# Altium project chicken.PrjPcb
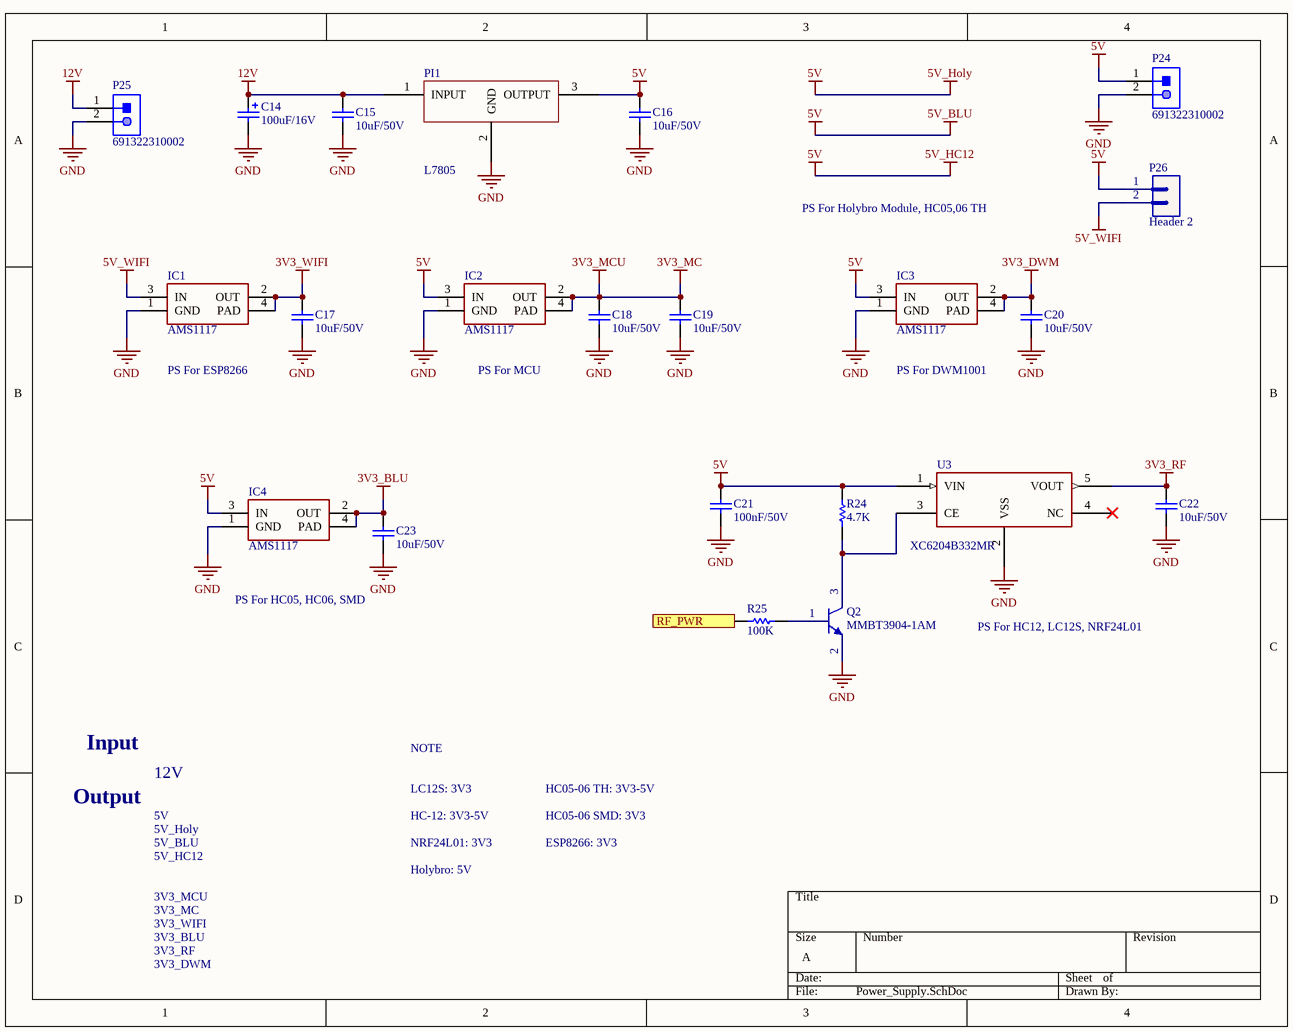
[diagram p0: Power_Supply.SchDoc]
8 sheets, 150 parts. Net scope: flat (ports and power ports of the same name join across sheets).
Board files: chicken.PcbDoc, test.PcbDoc, final.PcbDoc
Sheets:
  Power_Supply.SchDoc
  MCU.SchDoc
  Sensor.SchDoc
  Blutooth.SchDoc
  Wifi.SchDoc
  Motor Control.SchDoc
  RF.SchDoc
  Decawave.SchDoc

## Sheet Power_Supply.SchDoc
size A

### Parts
C14  value 100uF/16V  [CAP-SM-AL-SIZE-D-D6L6]  (hidden comment: Cap-Al-100uF-16V-D6L5)
C15  value 10uF/50V  [CAP-SM-0805]  (hidden comment: Cap-10uF-50V-0805)
C16  value 10uF/50V  [CAP-SM-0805]  (hidden comment: Cap-10uF-50V-0805)
C17  value 10uF/50V  [CAP-SM-0805]  (hidden comment: Cap-10uF-50V-0805)
C18  value 10uF/50V  [CAP-SM-0805]  (hidden comment: Cap-10uF-50V-0805)
C19  value 10uF/50V  [CAP-SM-0805]  (hidden comment: Cap-10uF-50V-0805)
C20  value 10uF/50V  [CAP-SM-0805]  (hidden comment: Cap-10uF-50V-0805)
C21  value 100nF/50V  [CAP-SM-0805]  (hidden comment: Cap-100nF-50V-0805)
C22  value 10uF/50V  [CAP-SM-0805]  (hidden comment: Cap-10uF-50V-0805)
C23  value 10uF/50V  [CAP-SM-0805]  (hidden comment: Cap-10uF-50V-0805)
IC1  AMS1117  [SOT223]
IC2  AMS1117  [SOT223]
IC3  AMS1117  [SOT223]
IC4  AMS1117  [SOT223]
P24  691322310002  [691322310002]
P25  691322310002  [691322310002]
P26  Header 2  [JP2]
PI1  L7805  [L7805_SMD]
Q2  MMBT3904-1AM  [SOT23_NEX]
R24  value 4.7K  [RES-SM-0805]  (hidden comment: Res-4.7K-0805)
R25  value 100K  [RES-SM-0805]  (hidden comment: Res-100K-0805)
U3  XC6204B332MR  [XC6204/05_SOT-00]

### Ports
RF_PWR (in)

### Nets
3V3_BLU: C23.2 IC4.2(OUT) IC4.4(PAD)
3V3_DWM: C20.2 IC3.2(OUT) IC3.4(PAD)
3V3_MC: C18.2 C19.2 IC2.2(OUT) IC2.4(PAD)  [also labelled 3V3_MCU]  [project net VDD]
3V3_RF: C22.2 U3.5(VOUT)
3V3_WIFI: C17.2 IC1.2(OUT) IC1.4(PAD)
5V: C16.2 C21.2 IC2.3(IN) IC3.3(IN) IC4.3(IN) P24.1 P26.1 PI1.3(OUTPUT) R24.2 U3.1(VIN)  [also labelled 5V_BLU, 5V_HC12, 5V_Holy]
5V_WIFI: IC1.3(IN) P26.2
12V: C14.1 C15.2 P25.1 PI1.1(INPUT)
GND: C14.2 C15.1 C16.1 C17.1 C18.1 C19.1 C20.1 C21.1 C22.1 C23.1 IC1.1(GND) IC2.1(GND) IC3.1(GND) IC4.1(GND) P24.2 P25.2 PI1.2(GND) Q2.2(E) U3.2(VSS)  [project net VSS]
NetCR1_15: R25.1 ; port RF_PWR
NetQ2_1: Q2.1(B) R25.2
NetQ2_3: Q2.3(C) R24.1 U3.3(CE)

Not connected (* = marked no-connect by the designer): U3 4(NC)*

### Notes on the sheet
- PS For Holybro Module, HC05,06 TH
- PS For ESP8266
- PS For MCU
- PS For DWM1001
- PS For HC05, HC06, SMD
- PS For HC12, LC12S, NRF24L01
- Input
- 12V
- NOTE
- Output
- 5V
- 5V_Holy
- 5V_BLU
- LC12S: 3V3
- HC-12: 3V3-5V
- NRF24L01: 3V3
- HC05-06 TH: 3V3-5V
- HC05-06 SMD: 3V3
- ESP8266: 3V3
- 5V_HC12
- 3V3_MCU
- 3V3_MC
- Holybro: 5V
- 3V3_WIFI
- 3V3_BLU
- 3V3_RF
- 3V3_DWM

### Library data of the parts
C14 = Cap-Al-100uF-16V-D6L5: CAP ALUM 100UF 20% 16V SMD; Manufacturer: Nichicon; Manufacturer Part Number: UWX1C101MCL1GB; Local Supplier: thegioiic; Local Supplier Link: https://thegioiic.com/products/tu-nhom-smd-100uf-16v-d6-3l5-4; Supplier 1: Digikey; Supplier 1 Part Number: 493-2105-1-ND; Supplier 1 Link: https://www.digikey.com/product-detail/en/nichicon/UWX1C101MCL1GB/493-2105-1-ND/590080
C15-C20 C22 C23 = Cap-10uF-50V-0805: CAP CER 10UF 50V X5R 0805; Manufacturer: Yageo; Manufacturer Part Number: CC0805KKX5R9BB106; Local Supplier: thegioiic; Local Supplier Link: https://thegioiic.com/products/tu-10uf-50v-0805; Supplier 1: Digikey; Supplier 1 Link: https://www.digikey.com/product-detail/en/yageo/CC0805KKX5R9BB106/311-3499-2-ND/7164383; Supplier 1 Part Number: 311-3499-2-ND
C21 = Cap-100nF-50V-0805: CAP CER 0.1UF 50V Y5V 0805; Manufacturer: Samsung Electro-Mechanics; Manufacturer Part Number: CL21F104ZBCNNNC; Local Supplier: thegioiic; Local Supplier Link: https://thegioiic.com/products/tu-100nf-0-1uf-50v-0805; Supplier 1: Digikey; Supplier 1 Part Number: 1276-1007-1-ND; Supplier 1 Link: https://www.digikey.com/product-detail/en/samsung-electro-mechanics/CL21F104ZBCNNNC/1276-1007-1-ND/3889093
IC1-IC4 = AMS1117: Available in 1.8V, 2.5V, 2.85V, 3.3V, 5V, and  Adjustable Versions; Value: LM317
P24 P25 = 691322310002: WR-TBL Serie 322 Horizontal PCB Header, Pluggable, pitch 3.81mm, 2p; Compliance: RoHS; Modularity: No; Pin Number: 2; Rated Current [UL]: 10A; Working Voltage [UL]: 300VAC; ComponentLink1Description: Manufacturer; ComponentLink1URL: http://www.we-online.de; ComponentLink2URL: https://katalog.we-online.de/em/datasheet/691322310002.pdf; ComponentLink2Description: Datasheet; Mounting Technology: THT; Part Number: 691322310002; Packaging: Box; Operating Temperature: -40 to +105degC; PCB/Cable/Panel: PCB; Pitch: 3.81mm; Published Date: October 2019; Type: Horizontal; Publisher: Wurth Elektronik; Application: Pluggable
P26 = Header 2: Header, 2-Pin; LatestRevisionDate: 17-Jul-2002; LatestRevisionNote: Re-released for DXP Platform.; Publisher: Altium Limited
R24 = Res-4.7K-0805: RES SMD 4.7K OHM 5% 1/8W 0805; Manufacturer: Yageo; Manufacturer Part Number: RC0805JR-074K7L; Local Supplier: thegioiic; Local Supplier Link: https://thegioiic.com/products/dien-tro-4-7k-ohm-0805-5; Supplier 1: Digikey; Supplier 1 Link: https://www.digikey.com/product-detail/en/yageo/RC0805JR-074K7L/311-4.7KARCT-ND/731274; Supplier 1 Part Number: 311-4.7KARCT-ND
R25 = Res-100K-0805: RES 0 OHM JUMPER 0805; Manufacturer: Vishay Dale; Manufacturer Part Number: WSL080500000ZEA9; Local Supplier: thegioiic; Local Supplier Link: https://thegioiic.com/products/dien-tro-0-ohm-0805-5; Supplier 1: Digikey; Supplier 1 Link: https://www.digikey.com/product-detail/en/vishay-dale/WSL080500000ZEA9/541-3928-1-ND/7423223; Supplier 1 Part Number: 541-3928-1-ND
U3 = XC6204B332MR: Vendor: Torex Semiconductor; Built_By: EMA_UL_Team; SourceLibrary: Torex_2016-07-05_1; Manufacturer_Part_Number: XC6204B332MR; Copyright: Copyright (C) 2018 Accelerated Designs. All rights reserved; RefDes: RefDes; Type: DEV

## Sheet MCU.SchDoc
size A
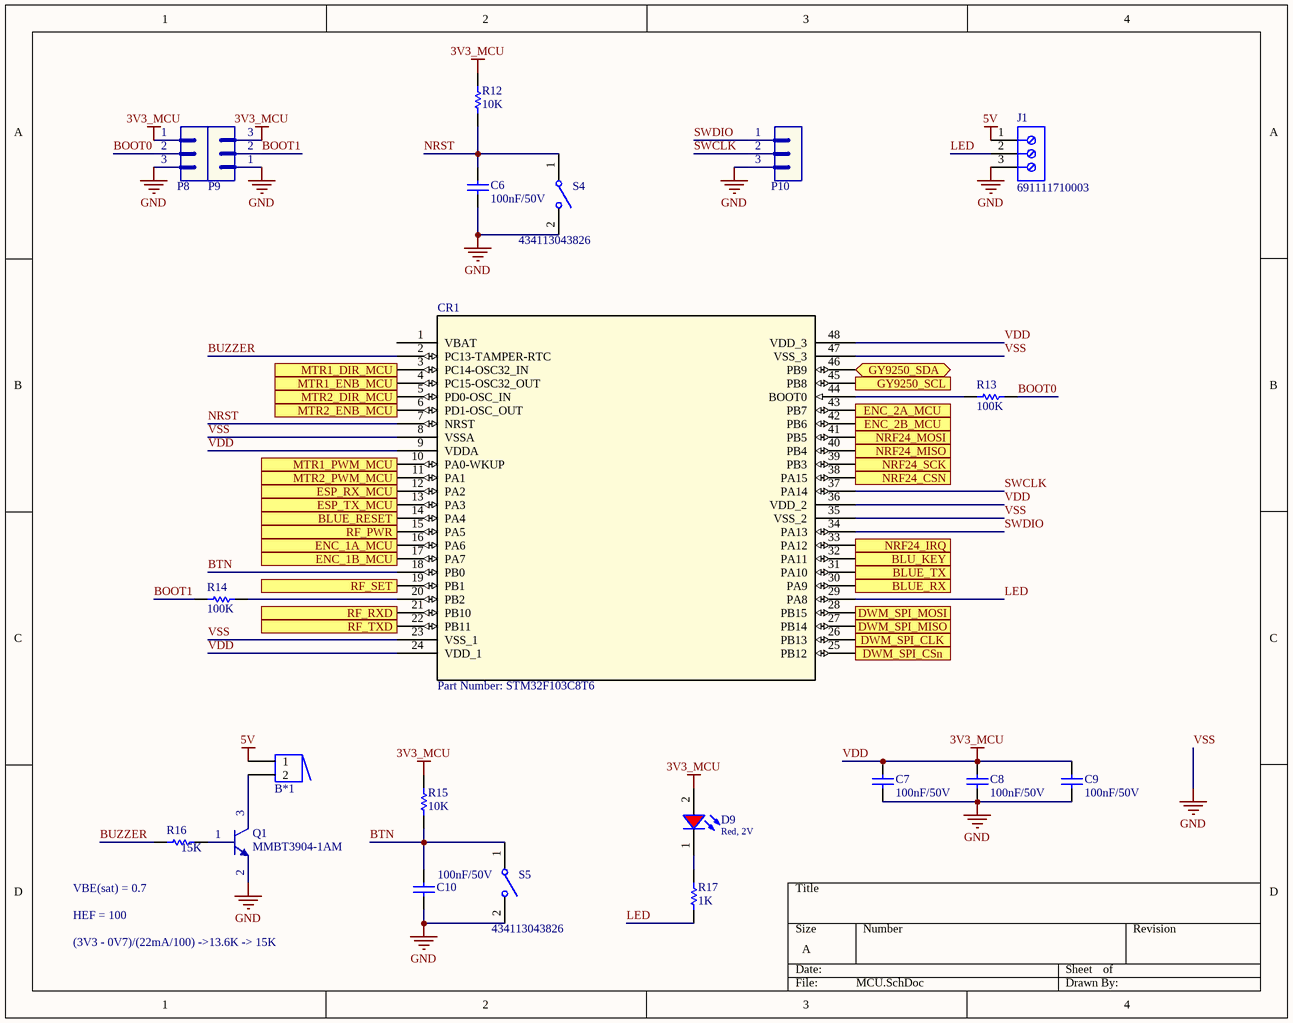
[diagram p1: MCU.SchDoc]

### Parts
B*1  Buzzer  [BUZZER]  (value not drawn)
C6  value 100nF/50V  [CAP-SM-0805]  (hidden comment: Cap-100nF-50V-0805)
C7  value 100nF/50V  [CAP-SM-0805]  (hidden comment: Cap-100nF-50V-0805)
C8  value 100nF/50V  [CAP-SM-0805]  (hidden comment: Cap-100nF-50V-0805)
C9  value 100nF/50V  [CAP-SM-0805]  (hidden comment: Cap-100nF-50V-0805)
C10  value 100nF/50V  [CAP-SM-0805]  (hidden comment: Cap-100nF-50V-0805)
CR1  Part Number: STM32F103C8T6  [LQFP-48]
D9  Red, 2V  [WL-SMCW_0805]
J1  691111710003  [691111710003]
P8  Header 3  [JP3]  (value not drawn)
P9  Header 3  [JP3]  (value not drawn)
P10  Header 3  [JP3]  (value not drawn)
Q1  MMBT3904-1AM  [SOT23_NEX]
R12  value 10K  [RES-SM-0805]  (hidden comment: Res-10k-0805)
R13  value 100K  [RES-SM-0805]  (hidden comment: Res-100K-0805)
R14  value 100K  [RES-SM-0805]  (hidden comment: Res-100K-0805)
R15  value 10K  [RES-SM-0805]  (hidden comment: Res-10k-0805)
R16  value 15K  [RES-SM-0805]  (hidden comment: Res-15K-0805)
R17  value 1K  [RES-SM-0805]  (hidden comment: Res-1K-0805)
S4  434113043826  [434113043826]
S5  434113043826  [434113043826]

### Ports
BLU_KEY (out), BLUE_RESET (out), BLUE_RX (out), BLUE_TX (in), DWM_SPI_CLK (out), DWM_SPI_CSn (out), DWM_SPI_MISO (in), DWM_SPI_MOSI (out), ENC_1A_MCU, ENC_1B_MCU, ENC_2A_MCU (in), ENC_2B_MCU (in), ESP_RX_MCU (out), ESP_TX_MCU (out), GY9250_SCL (out), GY9250_SDA (bidir), MTR1_DIR_MCU (out), MTR1_ENB_MCU (out), MTR1_PWM_MCU (out), MTR2_DIR_MCU (out), MTR2_ENB_MCU (out), MTR2_PWM_MCU, NRF24_CSN (out), NRF24_IRQ (in), NRF24_MISO (in), NRF24_MOSI (out), NRF24_SCK (out), RF_PWR, RF_RXD (out), RF_SET (out), RF_TXD (in)

### Nets
5V: B*1.1 J1.1
VDD: C7.2 C8.1 C9.1 CR1.9(VDDA) CR1.24(VDD_1) CR1.36(VDD_2) CR1.48(VDD_3) D9.2(A) P8.1 P9.3 R12.2 R15.2  [also labelled 3V3_MCU]
VSS: C6.1 C7.1 C8.2 C9.2 C10.1 CR1.8(VSSA) CR1.23(VSS_1) CR1.35(VSS_2) CR1.47(VSS_3) J1.3 P8.3 P9.1 P10.3 Q1.2(E) S4.2 S5.2  [also labelled GND]
BLU_KEY: CR1.32(PA11) ; port BLU_KEY
BLUE_RX: CR1.30(PA9) ; port BLUE_RX
BLUE_TX: CR1.31(PA10) ; port BLUE_TX
BOOT0: P8.2 R13.2
BOOT1: P9.2 R14.1
BTN: C10.2 CR1.18(PB0) R15.1 S5.1
BUZZER: CR1.2(PC13-TAMPER-RTC) R16.1
DWM_SPI_CLK: CR1.26(PB13) ; port DWM_SPI_CLK
DWM_SPI_CSn: CR1.25(PB12) ; port DWM_SPI_CSn
DWM_SPI_MISO: CR1.27(PB14) ; port DWM_SPI_MISO
DWM_SPI_MOSI: CR1.28(PB15) ; port DWM_SPI_MOSI
ESP_TX: CR1.13(PA3) ; port ESP_TX_MCU
LED: CR1.29(PA8) J1.2 R17.1
NRST: C6.2 CR1.7(NRST) R12.1 S4.1
RF_RXD: CR1.21(PB10) ; port RF_RXD
RF_SET: CR1.19(PB1) ; port RF_SET
RF_TXD: CR1.22(PB11) ; port RF_TXD
SWCLK: CR1.37(PA14) P10.2
SWDIO: CR1.34(PA13) P10.1
Net*1_11: CR1.14(PA4) ; port BLUE_RESET
NetB*1_2: B*1.2 Q1.3(C)
NetCR1_3: CR1.3(PC14-OSC32_IN) ; port MTR1_DIR_MCU
NetCR1_4: CR1.4(PC15-OSC32_OUT) ; port MTR1_ENB_MCU
NetCR1_5: CR1.5(PD0-OSC_IN) ; port MTR2_DIR_MCU
NetCR1_6: CR1.6(PD1-OSC_OUT) ; port MTR2_ENB_MCU
NetCR1_10: CR1.10(PA0-WKUP) ; port MTR1_PWM_MCU
NetCR1_11: CR1.11(PA1) ; port MTR2_PWM_MCU
NetCR1_12: CR1.12(PA2) ; port ESP_RX_MCU
NetCR1_15: CR1.15(PA5) ; port RF_PWR
NetCR1_16: CR1.16(PA6) ; port ENC_1A_MCU
NetCR1_17: CR1.17(PA7) ; port ENC_1B_MCU
NetCR1_20: CR1.20(PB2) R14.2
NetCR1_33: CR1.33(PA12) ; port NRF24_IRQ
NetCR1_38: CR1.38(PA15) ; port NRF24_CSN
NetCR1_39: CR1.39(PB3) ; port NRF24_SCK
NetCR1_40: CR1.40(PB4) ; port NRF24_MISO
NetCR1_41: CR1.41(PB5) ; port NRF24_MOSI
NetCR1_42: CR1.42(PB6) ; port ENC_2B_MCU
NetCR1_43: CR1.43(PB7) ; port ENC_2A_MCU
NetCR1_44: CR1.44(BOOT0) R13.1
NetCR1_45: CR1.45(PB8) ; port GY9250_SCL
NetCR1_46: CR1.46(PB9) ; port GY9250_SDA
NetD9_1: D9.1(K) R17.2
NetQ1_1: Q1.1(B) R16.2

Not connected (* = marked no-connect by the designer): CR1 1(VBAT)

### Notes on the sheet
- (near R16) VBE(sat) = 0.7
- HEF = 100
- (3V3 - 0V7)/(22mA/100) ->13.6K -> 15K

### Library data of the parts
C6-C10 = Cap-100nF-50V-0805: as C21 on sheet Power_Supply; Local Supplier: thegioiic; Local Supplier Link: https://thegioiic.com/products/tu-100nf-0-1uf-50v-0805; Supplier 1: Digikey; Supplier 1 Part Number: 1276-1007-1-ND; Supplier 1 Link: https://www.digikey.com/product-detail/en/samsung-electro-mechanics/CL21F104ZBCNNNC/1276-1007-1-ND/3889093
CR1 = STM32F103C8T6: No Description Available; Vendor: STMicroelectronics; Built_By: EMA_UL_Team; Type: DEV; Manufacturer_Part_Number: STM32F103C8T6; Copyright: Copyright (C) 2018 Accelerated Designs. All rights reserved; RefDes: RefDes; Value: Value
D9 = 150080RS75000: WL-SMCW SMT Mono-color Chip LED Waterclear, size 0805, Red, 2V, 140deg; Chip Technology: AlInGaP; Dominant Wavelength typ.: 625nm; Luminous Intensity typ.: 150mcd; Peak Wavelength typ.: 630nm; Viewing Angle: 140deg; ComponentLink1Description: Manufacturer; ComponentLink1URL: http://www.we-online.de; ComponentLink2URL: https://www.we-online.com/catalog/datasheet/150080RS75000.pdf; ComponentLink2Description: Datasheet; Forward Voltage typ.: 2V; Emitting Color: Red; Mounting Technology: SMT; Operating Temperature: -40 to +85degC; Published Date: December 2019; Part Number: 150080RS75000; Packaging: Tape and Reel; Size: 0805; Publisher: Wurth Elektronik
J1 = 691111710003: WR-TBL Serie 111 Horizontal Entry Modular, Pressure Clamp, pitch 5mm, 3p; Compliance: Lead free / RoHS; Modularity: Yes; PCB/Cable/Panel: PCB; Pin Number: 3; Rated Current [UL]: 15A; Working Voltage [UL]: 250VAC; ComponentLink1Description: Manufacturer; ComponentLink1URL: http://www.we-online.de; ComponentLink2URL: https://katalog.we-online.de/em/datasheet/691111710003.pdf; ComponentLink2Description: Datasheet; Mounting Technology: THT; Part Number: 691111710003; Packaging: Box; Operating Temperature: -40 to +105degC; Pitch: 5mm; Published Date: October 2019; Type: Horizontal; Publisher: Wurth Elektronik; Application: Pressure Clamp
P8-P10 = Header 3: Header, 3-Pin; LatestRevisionDate: 17-Jul-2002; LatestRevisionNote: Re-released for DXP Platform.; Publisher: Altium Limited
R12 R15 = Res-10k-0805: RES 10K OHM 1% 1/4W 0805; Manufacturer: Stackpole Electronics Inc; Manufacturer Part Number: RNCP0805FTD10K0; Local Supplier: thegioiic; Local Supplier Link: https://thegioiic.com/products/dien-tro-10k-ohm-0805-5; Supplier 1: Digikey; Supplier 1 Link: https://www.digikey.com/product-detail/en/stackpole-electronics-inc/RNCP0805FTD10K0/RNCP0805FTD10K0CT-ND/2240601; Supplier 1 Part Number: RNCP0805FTD10K0CT-ND
R13 R14 = Res-100K-0805: as R25 on sheet Power_Supply; Local Supplier: thegioiic; Local Supplier Link: https://thegioiic.com/products/dien-tro-0-ohm-0805-5; Supplier 1: Digikey; Supplier 1 Link: https://www.digikey.com/product-detail/en/vishay-dale/WSL080500000ZEA9/541-3928-1-ND/7423223; Supplier 1 Part Number: 541-3928-1-ND
R16 = Res-15K-0805: RES 15K OHM 1% 1/4W 0805; Manufacturer: TE Connectivity Passive Product; Manufacturer Part Number: CRGCQ0805F15K; Local Supplier: thegioiic; Local Supplier Link: https://thegioiic.com/products/dien-tro-15k-ohm-0805-1; Supplier 1: Digikey; Supplier 1 Part Number: A129763CT-ND; Supplier 1 Link: https://www.digikey.com/product-detail/en/te-connectivity-passive-product/CRGCQ0805F15K/A129763CT-ND/8577595
R17 = Res-1K-0805: RES 1K OHM 1% 1/4W 0805; Manufacturer: Stackpole Electronics Inc; Manufacturer Part Number: RNCP0805FTD1K00; Local Supplier: thegioiic; Local Supplier Link: https://thegioiic.com/products/dien-tro-1k-ohm-0805-5; Supplier 1: Digikey; Supplier 1 Link: https://www.digikey.com/product-detail/en/stackpole-electronics-inc/RNCP0805FTD1K00/RNCP0805FTD1K00CT-ND/2240568; Supplier 1 Part Number: RNCP0805FTD1K00CT-ND
S4 S5 = 434113043826: WS-TASV J-Bend SMT Tact Switch 6x3.5mm, height 4.3mm, 260gf; Rated Voltage: 12VDC; Rated Current: 50mA; Washable: No; ComponentLink1Description: Manufacturer; ComponentLink1URL: http://www.we-online.de; ComponentLink2Description: Datasheet; ComponentLink2URL: https://katalog.we-online.com/em/datasheet/434113043826.pdf; Operating Temperature: -40 to +85degC; Part Number: 434113043826; Published Date: September 2019; Contact Material: Stainless Steel; Height: 4.3mm; Mounting Technology: SMT; Contact Plating: Silver; Operation Force: 260gf; Packaging: Tape and Reel; Terminal Material: Copper Alloy; Publisher: Wurth Elektronik; Terminal Plating: Silver

## Sheet Sensor.SchDoc
size A
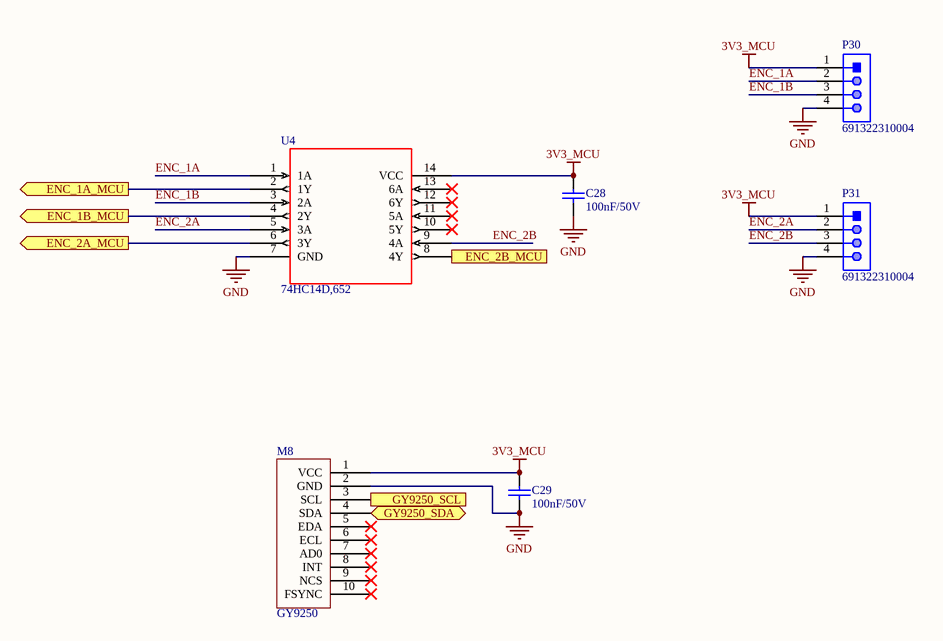
[diagram p2: Sensor.SchDoc]

### Parts
C28  value 100nF/50V  [CAP-SM-0805]  (hidden comment: Cap-100nF-50V-0805)
C29  value 100nF/50V  [CAP-SM-0805]  (hidden comment: Cap-100nF-50V-0805)
M8  GY9250  [GY9250]
P30  691322310004  [691322310004]
P31  691322310004  [691322310004]
U4  74HC14D,652  [74HC14D,652]

### Ports
ENC_1A_MCU (out), ENC_1B_MCU (out), ENC_2A_MCU (out), ENC_2B_MCU (out), GY9250_SCL (in), GY9250_SDA (bidir)

### Nets
3V3_MCU: C28.2 C29.2 M8.1(VCC) P30.1 P31.1 U4.14(VCC)  [project net VDD]
GND: C28.1 C29.1 M8.2(GND) P30.4 P31.4 U4.7(GND)  [project net VSS]
ENC_1A: P30.2 U4.1(1A)
ENC_1B: P30.3 U4.3(2A)
ENC_2A: P31.2 U4.5(3A)
ENC_2B: P31.3 U4.9(4A)
NetCR1_16: U4.2(1Y) ; port ENC_1A_MCU
NetCR1_17: U4.4(2Y) ; port ENC_1B_MCU
NetCR1_42: U4.8(4Y) ; port ENC_2B_MCU
NetCR1_43: U4.6(3Y) ; port ENC_2A_MCU
NetCR1_45: M8.3(SCL) ; port GY9250_SCL
NetCR1_46: M8.4(SDA) ; port GY9250_SDA

Not connected (* = marked no-connect by the designer): M8 5(EDA)* 6(ECL)* 7(AD0)* 8(INT)* 9(NCS)* 10(FSYNC)*; U4 10(5Y)* 11(5A)* 12(6Y)* 13(6A)*

### Library data of the parts
C28 C29 = Cap-100nF-50V-0805: as C21 on sheet Power_Supply; Local Supplier: thegioiic; Local Supplier Link: https://thegioiic.com/products/tu-100nf-0-1uf-50v-0805; Supplier 1: Digikey; Supplier 1 Part Number: 1276-1007-1-ND; Supplier 1 Link: https://www.digikey.com/product-detail/en/samsung-electro-mechanics/CL21F104ZBCNNNC/1276-1007-1-ND/3889093
P30 P31 = 691322310004: WR-TBL Serie 322 Horizontal PCB Header, Pluggable, pitch 3.81mm, 4p; Compliance: RoHS; Modularity: No; Pin Number: 4; Rated Current [UL]: 10A; Working Voltage [UL]: 300VAC; ComponentLink1Description: Manufacturer; ComponentLink1URL: http://www.we-online.de; ComponentLink2URL: https://katalog.we-online.de/em/datasheet/691322310004.pdf; ComponentLink2Description: Datasheet; Mounting Technology: THT; Part Number: 691322310004; Packaging: Box; Operating Temperature: -40 to +105degC; PCB/Cable/Panel: PCB; Pitch: 3.81mm; Published Date: October 2019; Type: Horizontal; Publisher: Wurth Elektronik; Application: Pluggable
U4 = 74HC14D,652: No Description Available; Vendor: Nexperia; SourceLibrary: Nexperia_2018-05-2018; Manufacturer_Part_Number: 74HC14D,652; Copyright: Copyright (C) 2016 Accelerated Designs. All rights reserved; RefDes: RefDes; Type: DEV
M8 = GY9250: Local Supplier: HShop; Local Supplier Link: https://hshop.vn/products/cam-bien-gy-9250-9dof-imu-mpu9250; Local Supplier Part Number: *; Manufacturer: *; Manufacturer Part Number: *

## Sheet Blutooth.SchDoc
size A
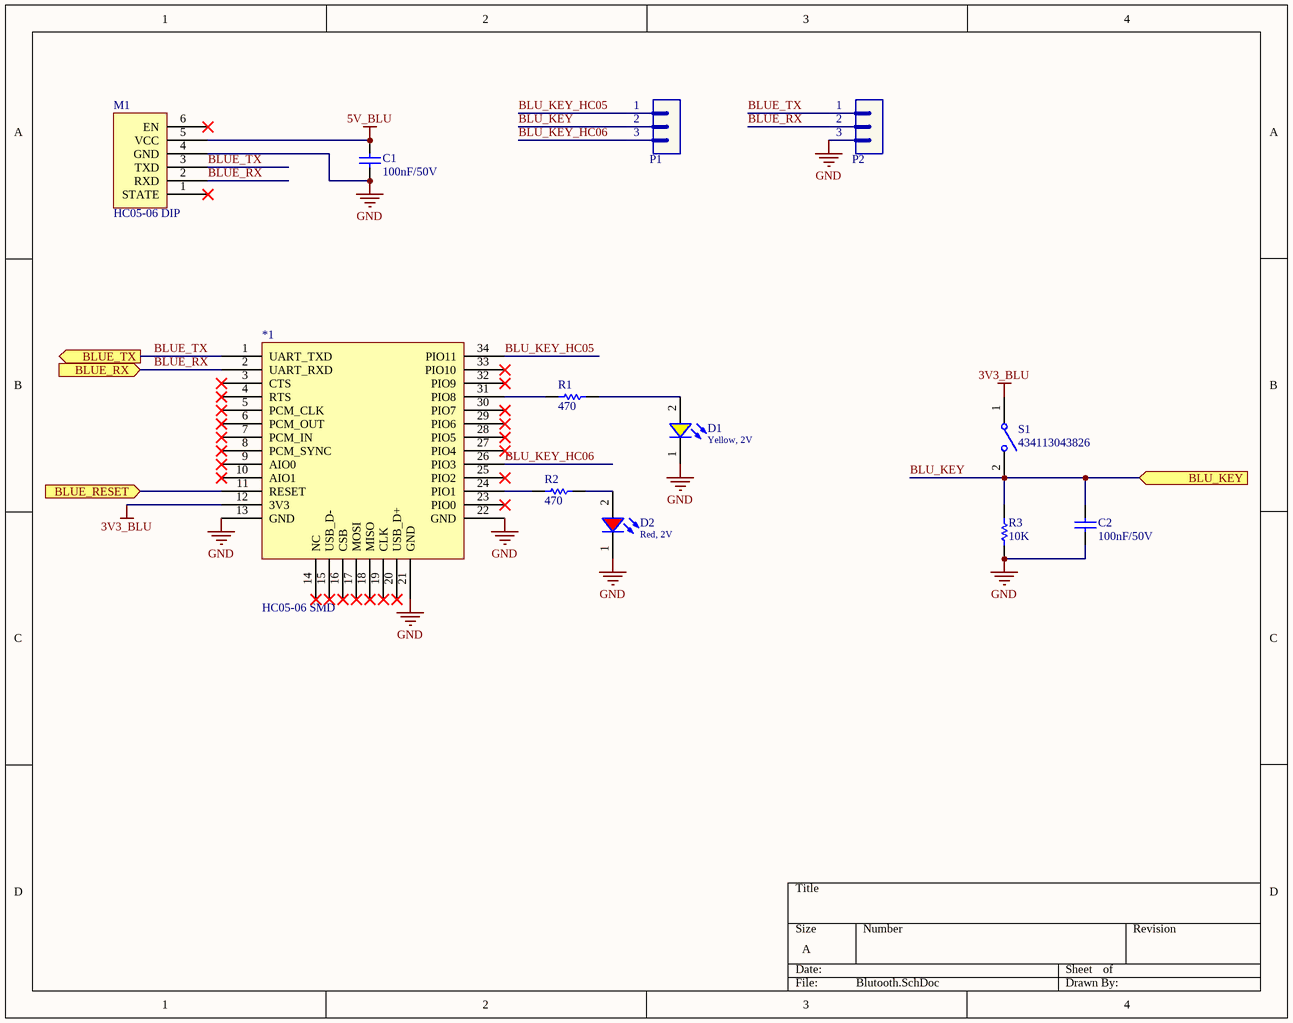
[diagram p3: Blutooth.SchDoc]

### Parts
*1  HC05-06 SMD  [HC05-06 SMD]
C1  value 100nF/50V  [CAP-SM-0805]  (hidden comment: Cap-100nF-50V-0805)
C2  value 100nF/50V  [CAP-SM-0805]  (hidden comment: Cap-100nF-50V-0805)
D1  Yellow, 2V  [WL-SMCW_0805]
D2  Red, 2V  [WL-SMCW_0805]
M1  HC05-06 DIP  [HC05-06 DIP]
P1  Header 3  [JP3]  (value not drawn)
P2  Header 3  [JP3]  (value not drawn)
R1  value 470  [RES-SM-0805]  (hidden comment: Res-470-0805)
R2  value 470  [RES-SM-0805]  (hidden comment: Res-470-0805)
R3  value 10K  [RES-SM-0805]  (hidden comment: Res-10k-0805)
S1  434113043826  [434113043826]

### Ports
BLU_KEY (in), BLUE_RESET (in), BLUE_RX (in), BLUE_TX (out)

### Nets
3V3_BLU: *1.12(3V3) S1.1
5V_BLU: C1.2 M1.5(VCC)  [project net 5V]
GND: *1.13(GND) *1.21(GND) *1.22(GND) C1.1 C2.1 D1.1(K) D2.1(K) M1.4(GND) P2.3 R3.2  [project net VSS]
BLU_KEY: C2.2 P1.2 R3.1 S1.2 ; port BLU_KEY
BLU_KEY_HC05: *1.34(PIO11) P1.1
BLU_KEY_HC06: *1.26(PIO3) P1.3
BLUE_RX: *1.2(UART_RXD) M1.2(RXD) P2.2 ; port BLUE_RX
BLUE_TX: *1.1(UART_TXD) M1.3(TXD) P2.1 ; port BLUE_TX
Net*1_11: *1.11(RESET) ; port BLUE_RESET
Net*1_24: *1.24(PIO1) R2.1
Net*1_31: *1.31(PIO8) R1.1
NetD1_2: D1.2(A) R1.2
NetD2_2: D2.2(A) R2.2

Not connected (* = marked no-connect by the designer): *1 3(CTS)* 4(RTS)* 5(PCM_CLK)* 6(PCM_OUT)* 7(PCM_IN)* 8(PCM_SYNC)* 9(AIO0)* 10(AIO1)* 14(NC)* 15(USB_D-)* 16(CSB)* 17(MOSI)* 18(MISO)* 19(CLK)* 20(USB_D+)* 23(PIO0)* 25(PIO2)* 27(PIO4)* 28(PIO5)* 29(PIO6)* 30(PIO7)* 32(PIO9)* 33(PIO10)*; M1 1(STATE)* 6(EN)*

### Library data of the parts
C1 C2 = Cap-100nF-50V-0805: as C21 on sheet Power_Supply; Local Supplier: thegioiic; Local Supplier Link: https://thegioiic.com/products/tu-100nf-0-1uf-50v-0805; Supplier 1: Digikey; Supplier 1 Part Number: 1276-1007-1-ND; Supplier 1 Link: https://www.digikey.com/product-detail/en/samsung-electro-mechanics/CL21F104ZBCNNNC/1276-1007-1-ND/3889093
D1 = 150080YS75000: WL-SMCW SMT Mono-color Chip LED Waterclear, size 0805, Yellow, 2V, 140deg; Chip Technology: AlInGaP; Dominant Wavelength typ.: 590nm; Luminous Intensity typ.: 120mcd; Peak Wavelength typ.: 595nm; Viewing Angle: 140deg; ComponentLink1Description: Manufacturer; ComponentLink1URL: http://www.we-online.de; ComponentLink2URL: https://www.we-online.com/catalog/datasheet/150080YS75000.pdf; ComponentLink2Description: Datasheet; Forward Voltage typ.: 2V; Emitting Color: Yellow; Mounting Technology: SMT; Operating Temperature: -40 to +85degC; Published Date: December 2019; Part Number: 150080YS75000; Packaging: Tape and Reel; Size: 0805; Publisher: Wurth Elektronik
D2 = 150080RS75000: as D9 on sheet MCU; Viewing Angle: 140deg; ComponentLink1Description: Manufacturer; ComponentLink1URL: http://www.we-online.de; ComponentLink2URL: https://www.we-online.com/catalog/datasheet/150080RS75000.pdf; ComponentLink2Description: Datasheet; Forward Voltage typ.: 2V; Emitting Color: Red; Mounting Technology: SMT; Operating Temperature: -40 to +85degC; Published Date: December 2019; Part Number: 150080RS75000; Packaging: Tape and Reel; Size: 0805; Publisher: Wurth Elektronik
P1 P2 = Header 3: Header, 3-Pin; LatestRevisionDate: 17-Jul-2002; LatestRevisionNote: Re-released for DXP Platform.; Publisher: Altium Limited
R1 R2 = Res-470-0805: RES 470 OHM JUMPER 0805; Manufacturer: YAG6006CT-ND; Manufacturer Part Number: PE0805FRF7W0R047L; Local Supplier: thegioiic; Local Supplier Link: https://www.thegioiic.com/products/dien-tro-470-kohm-0805-5; Supplier 1: Digikey; Supplier 1 Link: https://www.digikey.com/product-detail/en/yageo/PE0805FRF7W0R047L/YAG6006CT-ND/9696460; Supplier 1 Part Number: YAG6006CT-ND
R3 = Res-10k-0805: as R12 on sheet MCU; Local Supplier: thegioiic; Local Supplier Link: https://thegioiic.com/products/dien-tro-10k-ohm-0805-5; Supplier 1: Digikey; Supplier 1 Link: https://www.digikey.com/product-detail/en/stackpole-electronics-inc/RNCP0805FTD10K0/RNCP0805FTD10K0CT-ND/2240601; Supplier 1 Part Number: RNCP0805FTD10K0CT-ND
S1 = 434113043826: as S4 on sheet MCU; ComponentLink1Description: Manufacturer; ComponentLink1URL: http://www.we-online.de; ComponentLink2Description: Datasheet; ComponentLink2URL: https://katalog.we-online.com/em/datasheet/434113043826.pdf; Operating Temperature: -40 to +85degC; Part Number: 434113043826; Published Date: September 2019; Contact Material: Stainless Steel; Height: 4.3mm; Mounting Technology: SMT; Contact Plating: Silver; Operation Force: 260gf; Packaging: Tape and Reel; Terminal Material: Copper Alloy; Publisher: Wurth Elektronik; Terminal Plating: Silver

## Sheet Wifi.SchDoc
size A
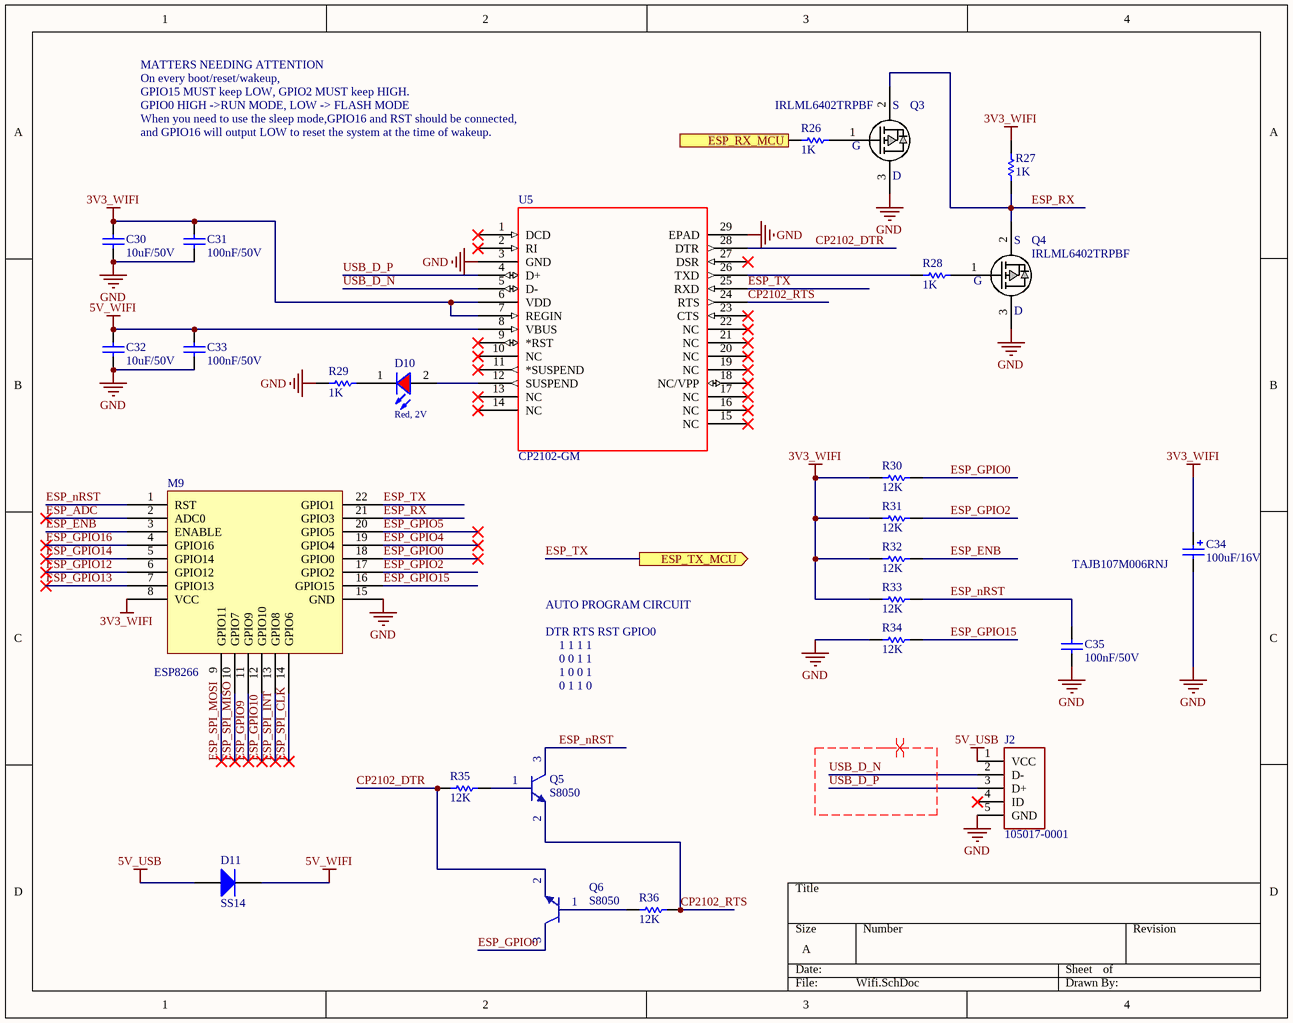
[diagram p4: Wifi.SchDoc]

### Parts
C30  value 10uF/50V  [CAP-SM-0805]  (hidden comment: Cap-10uF-50V-0805)
C31  value 100nF/50V  [CAP-SM-0805]  (hidden comment: Cap-100nF-50V-0805)
C32  value 10uF/50V  [CAP-SM-0805]  (hidden comment: Cap-10uF-50V-0805)
C33  value 100nF/50V  [CAP-SM-0805]  (hidden comment: Cap-100nF-50V-0805)
C34  value 100uF/16V  [CAP_SM_TAN]  (hidden comment: TAJB107M006RNJ)
C35  value 100nF/50V  [CAP-SM-0805]  (hidden comment: Cap-100nF-50V-0805)
D10  Red, 2V  [WL-SMCW_0805]
D11  SS14  [SS14]
J2  105017-0001  [CONN_105017-0001]
M9  ESP8266  [ESP8266]
Q3  IRLML6402TRPBF  [SOT23_NEX]
Q4  IRLML6402TRPBF  [SOT23_NEX]
Q5  S8050  [SOT23_NEX]
Q6  S8050  [SOT23_NEX]
R26  value 1K  [RES-SM-0805]  (hidden comment: Res-1K-0805)
R27  value 1K  [RES-SM-0805]  (hidden comment: Res-1K-0805)
R28  value 1K  [RES-SM-0805]  (hidden comment: Res-1K-0805)
R29  value 1K  [RES-SM-0805]  (hidden comment: Res-1K-0805)
R30  value 12K  [RES-SM-0805]  (hidden comment: Res-12K-0805)
R31  value 12K  [RES-SM-0805]  (hidden comment: Res-12K-0805)
R32  value 12K  [RES-SM-0805]  (hidden comment: Res-12K-0805)
R33  value 12K  [RES-SM-0805]  (hidden comment: Res-12K-0805)
R34  value 12K  [RES-SM-0805]  (hidden comment: Res-12K-0805)
R35  value 12K  [RES-SM-0805]  (hidden comment: Res-12K-0805)
R36  value 12K  [RES-SM-0805]  (hidden comment: Res-12K-0805)
U5  CP2102-GM  [CP2102-GM]

### Ports
ESP_RX_MCU (in), ESP_TX_MCU (out)

### Nets
3V3_WIFI: C30.2 C31.2 C34.1 M9.8(VCC) R27.2 R30.1 R31.1 R32.1 R33.1 U5.6(VDD) U5.7(REGIN)
5V_USB: D11.2(A) J2.1(VCC)
5V_WIFI: C32.2 C33.2 D11.1(K) U5.8(VBUS)
GND: C30.1 C31.1 C32.1 C33.1 C34.2 C35.1 J2.5(GND) M9.15(GND) Q3.3(D) Q4.3(D) R29.1 R34.1 U5.3(GND) U5.29(EPAD)  [project net VSS]
CP2102_DTR: Q6.2(E) R35.1 U5.28(DTR)
CP2102_RTS: Q5.2(E) R36.2 U5.24(RTS)
ESP_ADC: M9.2(ADC0)
ESP_ENB: M9.3(ENABLE) R32.2
ESP_GPIO0: M9.18(GPIO0) Q6.3(C) R30.2
ESP_GPIO2: M9.17(GPIO2) R31.2
ESP_GPIO4: M9.19(GPIO4)
ESP_GPIO5: M9.20(GPIO5)
ESP_GPIO9: M9.11(GPIO9)
ESP_GPIO10: M9.12(GPIO10)
ESP_GPIO12: M9.6(GPIO12)
ESP_GPIO13: M9.7(GPIO13)
ESP_GPIO14: M9.5(GPIO14)
ESP_GPIO15: M9.16(GPIO15) R34.2
ESP_GPIO16: M9.4(GPIO16)
ESP_nRST: C35.2 M9.1(RST) Q5.3(C) R33.2
ESP_RX: M9.21(GPIO3) Q3.2(S) Q4.2(S) R27.1
ESP_SPI_CLK: M9.14(GPIO6)
ESP_SPI_INT: M9.13(GPIO8)
ESP_SPI_MISO: M9.10(GPIO7)
ESP_SPI_MOSI: M9.9(GPIO11)
ESP_TX: M9.22(GPIO1) U5.25(RXD) ; port ESP_TX_MCU
USB_D_N: J2.2(D-) U5.5(D-)
USB_D_P: J2.3(D+) U5.4(D+)
NetCR1_12: R26.2 ; port ESP_RX_MCU
NetD10_1: D10.1(K) R29.2
NetD10_2: D10.2(A) U5.12(SUSPEND)
NetQ3_1: Q3.1(G) R26.1
NetQ4_1: Q4.1(G) R28.2
NetQ5_1: Q5.1(B) R35.2
NetQ6_1: Q6.1(B) R36.1
NetR28_1: R28.1 U5.26(TXD)

Not connected (* = marked no-connect by the designer): J2 4(ID)*; U5 1(DCD)* 2(RI)* 9(*RST)* 10(NC)* 11(*SUSPEND)* 13(NC)* 14(NC)* 15(NC)* 16(NC)* 17(NC)* 18(NC/VPP)* 19(NC)* 20(NC)* 21(NC)* 22(NC)* 23(CTS)* 27(DSR)*

### Layout directives
differential pair: USB_D_N, USB_D_P

### Notes on the sheet
- MATTERS NEEDING ATTENTION
- On every boot/reset/wakeup,
- GPIO15 MUST keep LOW, GPIO2 MUST keep HIGH.
- GPIO0 HIGH ->RUN MODE, LOW -> FLASH MODE
- When you need to use the sleep mode,GPIO16 and RST should be connected,
- and GPIO16 will output LOW to reset the system at the time of wakeup.
- (near C34) TAJB107M006RNJ
- AUTO PROGRAM CIRCUIT
- DTR RTS RST GPIO0
- 1 1 1 1
- 0 0 1 1
- 1 0 0 1
- 0 1 1 0

### Library data of the parts
C30 C32 = Cap-10uF-50V-0805: as C15 on sheet Power_Supply; Local Supplier: thegioiic; Local Supplier Link: https://thegioiic.com/products/tu-10uf-50v-0805; Supplier 1: Digikey; Supplier 1 Link: https://www.digikey.com/product-detail/en/yageo/CC0805KKX5R9BB106/311-3499-2-ND/7164383; Supplier 1 Part Number: 311-3499-2-ND
C31 C33 C35 = Cap-100nF-50V-0805: as C21 on sheet Power_Supply; Local Supplier: thegioiic; Local Supplier Link: https://thegioiic.com/products/tu-100nf-0-1uf-50v-0805; Supplier 1: Digikey; Supplier 1 Part Number: 1276-1007-1-ND; Supplier 1 Link: https://www.digikey.com/product-detail/en/samsung-electro-mechanics/CL21F104ZBCNNNC/1276-1007-1-ND/3889093
C34 = Cap-Tan-100uF-16V: Manufacturer: Nichicon; Manufacturer Part Number: UWX1C101MCL1GB; Local Supplier: icdayroi; Local Supplier Link: https://icdayroi.com/tu-tantalum-100uf-16v-smd6032; Supplier 1: Digikey; Supplier 1 Part Number: 493-2105-1-ND; Supplier 1 Link: https://www.digikey.com/product-detail/en/nichicon/UWX1C101MCL1GB/493-2105-1-ND/590080
D10 = 150080RS75000: as D9 on sheet MCU; Viewing Angle: 140deg; ComponentLink1Description: Manufacturer; ComponentLink1URL: http://www.we-online.de; ComponentLink2URL: https://www.we-online.com/catalog/datasheet/150080RS75000.pdf; ComponentLink2Description: Datasheet; Forward Voltage typ.: 2V; Emitting Color: Red; Mounting Technology: SMT; Operating Temperature: -40 to +85degC; Published Date: December 2019; Part Number: 150080RS75000; Packaging: Tape and Reel; Size: 0805; Publisher: Wurth Elektronik
D11 = Diode-SS14: DIODE SCHOTTKY 40V 1A SMA; Manufacturer: ON Semiconductor; Local Supplier: thegioiic; Local Supplier Link: https://thegioiic.com/products/ss14-sma; Supplier 1: Digikey; Supplier 1 Link: https://www.digikey.com/product-detail/en/on-semiconductor/SS14/SS14CT-ND/965729; Manufacturer Part Number: SS14; Supplier 1 Part Number: SS14CT-ND
J2 = 105017-0001: No Description Available; Vendor: Molex Connector Corporation; Built_By: EMA_Cory; SourceLibrary: Molex_2020-05-26; Datasheet: https://www.molex.com/pdm_docs/sd/1050170001_sd.pdf; Manufacturer_Part_Number: 105017-0001; Copyright: Copyright (C) 2018 Accelerated Designs. All rights reserved; RefDes: RefDes; Type: DEV
Q3 Q4 = IRLML6402TRPBF: P-Channel 20V 3.7A (Ta) 1.3W (Ta) Surface Mount Micro3™/SOT-23
R26-R29 = Res-1K-0805: as R17 on sheet MCU; Local Supplier: thegioiic; Local Supplier Link: https://thegioiic.com/products/dien-tro-1k-ohm-0805-5; Supplier 1: Digikey; Supplier 1 Link: https://www.digikey.com/product-detail/en/stackpole-electronics-inc/RNCP0805FTD1K00/RNCP0805FTD1K00CT-ND/2240568; Supplier 1 Part Number: RNCP0805FTD1K00CT-ND
R30-R36 = Res-12K-0805: RES 12 KOHM JUMPER 0805; Manufacturer: Vishay Thin Film; Manufacturer Part Number: PAT0805E3121BST1; Local Supplier: icdayroi; Local Supplier Link: https://icdayroi.com/dien-tro-12k-0805-1-goi-50-con; Supplier 1: Digikey; Supplier 1 Link: https://www.digikey.com/product-detail/en/vishay-thin-film/PAT0805E3121BST1/PAT0805E3121BST1-ND/2281536; Supplier 1 Part Number: PAT0805E3121BST1-ND
U5 = CP2102-GM: No Description Available; Vendor: Silicon Labs; Built_By: EMA_UL_Team; SourceLibrary: Silicon_Labs_2015-03-23; Manufacturer_Part_Number: CP2102-GM; Copyright: Copyright (C) 2018 Accelerated Designs. All rights reserved; RefDes: RefDes; Type: DEV

## Sheet Motor Control.SchDoc
size A
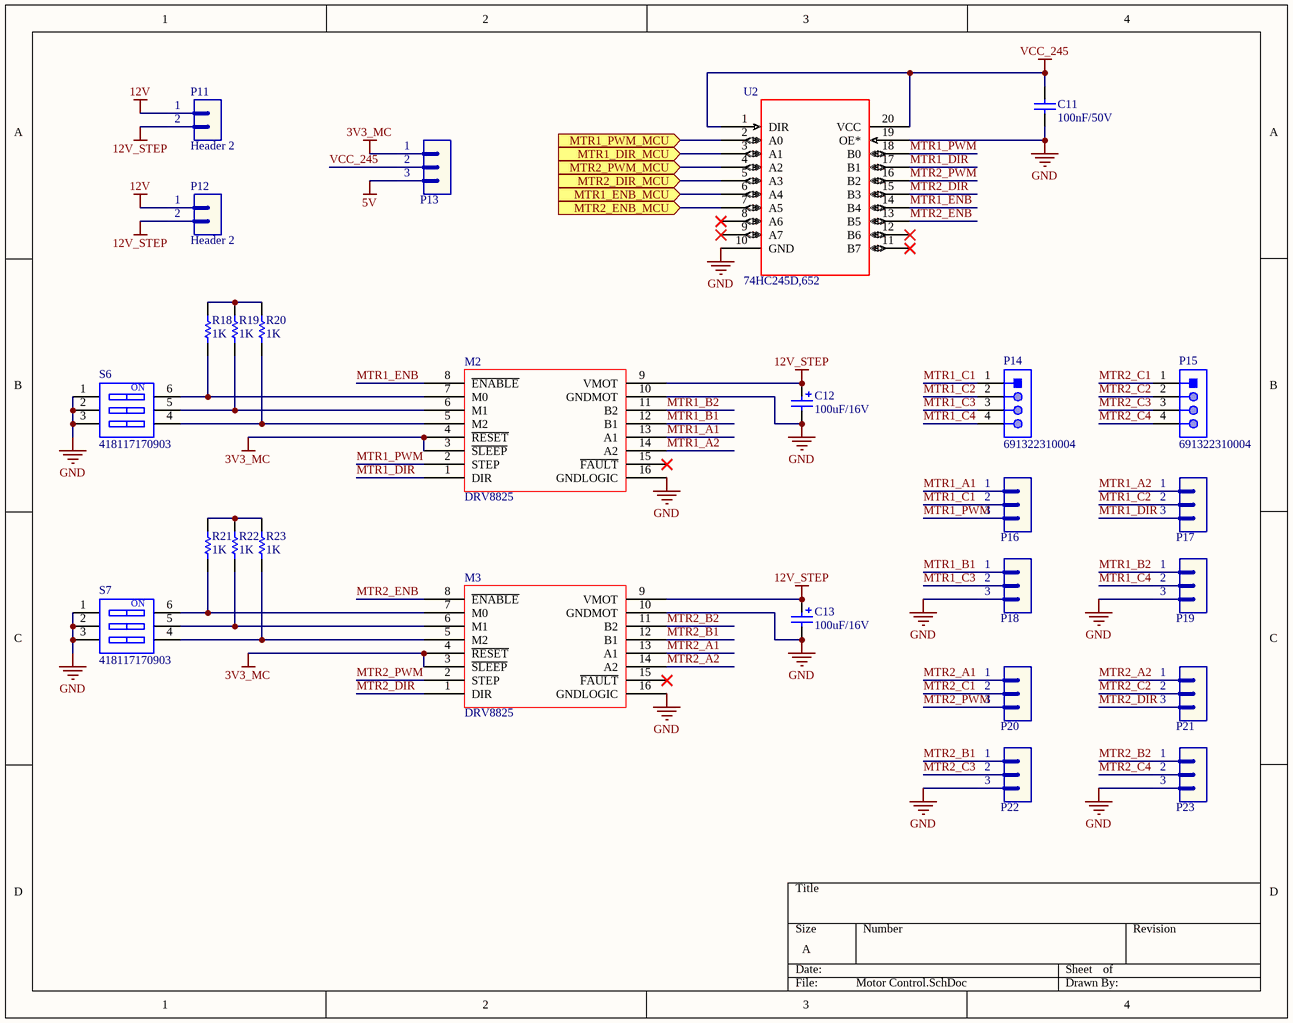
[diagram p5: Motor Control.SchDoc]

### Parts
C11  value 100nF/50V  [CAP-SM-0805]  (hidden comment: Cap-100nF-50V-0805)
C12  value 100uF/16V  [CAP-SM-AL-SIZE-D-D6L6]  (hidden comment: Cap-Al-100uF-16V-D6L5)
C13  value 100uF/16V  [CAP-SM-AL-SIZE-D-D6L6]  (hidden comment: Cap-Al-100uF-16V-D6L5)
M2  DRV8825  [DRV8825]
M3  DRV8825  [DRV8825]
P11  Header 2  [JP2]
P12  Header 2  [JP2]
P13  Header 3  [JP3]  (value not drawn)
P14  691322310004  [691322310004]
P15  691322310004  [691322310004]
P16  Header 3  [JP3]  (value not drawn)
P17  Header 3  [JP3]  (value not drawn)
P18  Header 3  [JP3]  (value not drawn)
P19  Header 3  [JP3]  (value not drawn)
P20  Header 3  [JP3]  (value not drawn)
P21  Header 3  [JP3]  (value not drawn)
P22  Header 3  [JP3]  (value not drawn)
P23  Header 3  [JP3]  (value not drawn)
R18  value 1K  [RES-SM-0805]  (hidden comment: Res-1K-0805)
R19  value 1K  [RES-SM-0805]  (hidden comment: Res-1K-0805)
R20  value 1K  [RES-SM-0805]  (hidden comment: Res-1K-0805)
R21  value 1K  [RES-SM-0805]  (hidden comment: Res-1K-0805)
R22  value 1K  [RES-SM-0805]  (hidden comment: Res-1K-0805)
R23  value 1K  [RES-SM-0805]  (hidden comment: Res-1K-0805)
S6  418117170903  [418117170903]
S7  418117170903  [418117170903]
U2  74HC245D,652  [74HC245D,652]

### Ports
MTR1_DIR_MCU (in), MTR1_ENB_MCU (in), MTR1_PWM_MCU (in), MTR2_DIR_MCU (in), MTR2_ENB_MCU (in), MTR2_PWM_MCU (in)

### Nets
3V3_MC: M2.3(~{SLEEP}) M2.4(~{RESET}) M3.3(~{SLEEP}) M3.4(~{RESET}) P13.1  [project net VDD]
5V: P13.3
12V: P11.1 P12.1
12V_STEP: C12.1 C13.1 M2.9(VMOT) M3.9(VMOT) P11.2 P12.2
GND: C11.1 C12.2 C13.2 M2.10(GNDMOT) M2.16(GNDLOGIC) M3.10(GNDMOT) M3.16(GNDLOGIC) P18.3 P19.3 P22.3 P23.3 S6.1 S6.2 S6.3 S7.1 S7.2 S7.3 U2.10(GND) U2.19(OE*)  [project net VSS]
VCC_245: C11.2 P13.2 U2.1(DIR) U2.20(VCC)
MTR1_A1: M2.13(A1) P16.1
MTR1_A2: M2.14(A2) P17.1
MTR1_B1: M2.12(B1) P18.1
MTR1_B2: M2.11(B2) P19.1
MTR1_C1: P14.1 P16.2
MTR1_C2: P14.2 P17.2
MTR1_C3: P14.3 P18.2
MTR1_C4: P14.4 P19.2
MTR1_DIR: M2.1(DIR) P17.3 U2.17(B1)
MTR1_ENB: M2.8(~{ENABLE}) U2.14(B4)
MTR1_PWM: M2.2(STEP) P16.3 U2.18(B0)
MTR2_A1: M3.13(A1) P20.1
MTR2_A2: M3.14(A2) P21.1
MTR2_B1: M3.12(B1) P22.1
MTR2_B2: M3.11(B2) P23.1
MTR2_C1: P15.1 P20.2
MTR2_C2: P15.2 P21.2
MTR2_C3: P15.3 P22.2
MTR2_C4: P15.4 P23.2
MTR2_DIR: M3.1(DIR) P21.3 U2.15(B3)
MTR2_ENB: M3.8(~{ENABLE}) U2.13(B5)
MTR2_PWM: M3.2(STEP) P20.3 U2.16(B2)
NetCR1_3: U2.3(A1) ; port MTR1_DIR_MCU
NetCR1_4: U2.6(A4) ; port MTR1_ENB_MCU
NetCR1_5: U2.5(A3) ; port MTR2_DIR_MCU
NetCR1_6: U2.7(A5) ; port MTR2_ENB_MCU
NetCR1_10: U2.2(A0) ; port MTR1_PWM_MCU
NetCR1_11: U2.4(A2) ; port MTR2_PWM_MCU
NetM2_5: M2.5(M2) R20.1 S6.4
NetM2_6: M2.6(M1) R19.1 S6.5
NetM2_7: M2.7(M0) R18.1 S6.6
NetM3_5: M3.5(M2) R23.1 S7.4
NetM3_6: M3.6(M1) R22.1 S7.5
NetM3_7: M3.7(M0) R21.1 S7.6
NetR18_2: R18.2 R19.2 R20.2
NetR21_2: R21.2 R22.2 R23.2

Not connected (* = marked no-connect by the designer): M2 15(~{FAULT})*; M3 15(~{FAULT})*; U2 8(A6)* 9(A7)* 11(B7)* 12(B6)*

### Notes on the sheet
- (in symbol 418117170903) ON

### Library data of the parts
C11 = Cap-100nF-50V-0805: as C21 on sheet Power_Supply; Local Supplier: thegioiic; Local Supplier Link: https://thegioiic.com/products/tu-100nf-0-1uf-50v-0805; Supplier 1: Digikey; Supplier 1 Part Number: 1276-1007-1-ND; Supplier 1 Link: https://www.digikey.com/product-detail/en/samsung-electro-mechanics/CL21F104ZBCNNNC/1276-1007-1-ND/3889093
C12 C13 = Cap-Al-100uF-16V-D6L5: as C14 on sheet Power_Supply; Local Supplier: thegioiic; Local Supplier Link: https://thegioiic.com/products/tu-nhom-smd-100uf-16v-d6-3l5-4; Supplier 1: Digikey; Supplier 1 Part Number: 493-2105-1-ND; Supplier 1 Link: https://www.digikey.com/product-detail/en/nichicon/UWX1C101MCL1GB/493-2105-1-ND/590080
P11 P12 = Header 2: Header, 2-Pin; LatestRevisionDate: 17-Jul-2002; LatestRevisionNote: Re-released for DXP Platform.; Publisher: Altium Limited
P13 P16-P23 = Header 3: Header, 3-Pin; LatestRevisionDate: 17-Jul-2002; LatestRevisionNote: Re-released for DXP Platform.; Publisher: Altium Limited
P14 P15 = 691322310004: as P30 on sheet Sensor; ComponentLink1Description: Manufacturer; ComponentLink1URL: http://www.we-online.de; ComponentLink2URL: https://katalog.we-online.de/em/datasheet/691322310004.pdf; ComponentLink2Description: Datasheet; Mounting Technology: THT; Part Number: 691322310004; Packaging: Box; Operating Temperature: -40 to +105degC; PCB/Cable/Panel: PCB; Pitch: 3.81mm; Published Date: October 2019; Type: Horizontal; Publisher: Wurth Elektronik; Application: Pluggable
R18-R23 = Res-1K-0805: as R17 on sheet MCU; Local Supplier: thegioiic; Local Supplier Link: https://thegioiic.com/products/dien-tro-1k-ohm-0805-5; Supplier 1: Digikey; Supplier 1 Link: https://www.digikey.com/product-detail/en/stackpole-electronics-inc/RNCP0805FTD1K00/RNCP0805FTD1K00CT-ND/2240568; Supplier 1 Part Number: RNCP0805FTD1K00CT-ND
S6 S7 = 418117170903: WS-DITV Compact THT Dip Switch, Flat Actuator, pitch 2.54mm, 3p; Operation Force: 800g; Pole Number: 3; Actuator Type: Flat Type; Circuit: SPST-NO; Rated Current Switching: 25mA; Rated Current Non-Switching: 100mA; Rated Voltage Non-Switching: 50VDC; Rated Voltage Switching: 24VDC; ComponentLink1Description: Manufacturer; ComponentLink1URL: http://www.we-online.de; ComponentLink2Description: Datasheet; ComponentLink2URL: https://katalog.we-online.com/em/datasheet/418117170903.pdf; Pitch: 2.54mm; Contact Material: Copper Alloy; Mounting Technology: THT; Operating Temperature: -40 to +85degC; Contact Plating: Gold; Packaging: Tube; Part Number: 418117170903; Publisher: Wurth Elektronik; Published Date: September 2019
U2 = 74HC245D,652: No Description Available; Vendor: Nexperia; SourceLibrary: Nexperia_2018-05-2018; Manufacturer_Part_Number: 74HC245D,652; Copyright: Copyright (C) 2016 Accelerated Designs. All rights reserved; RefDes: RefDes; Type: DEV

## Sheet RF.SchDoc
size A
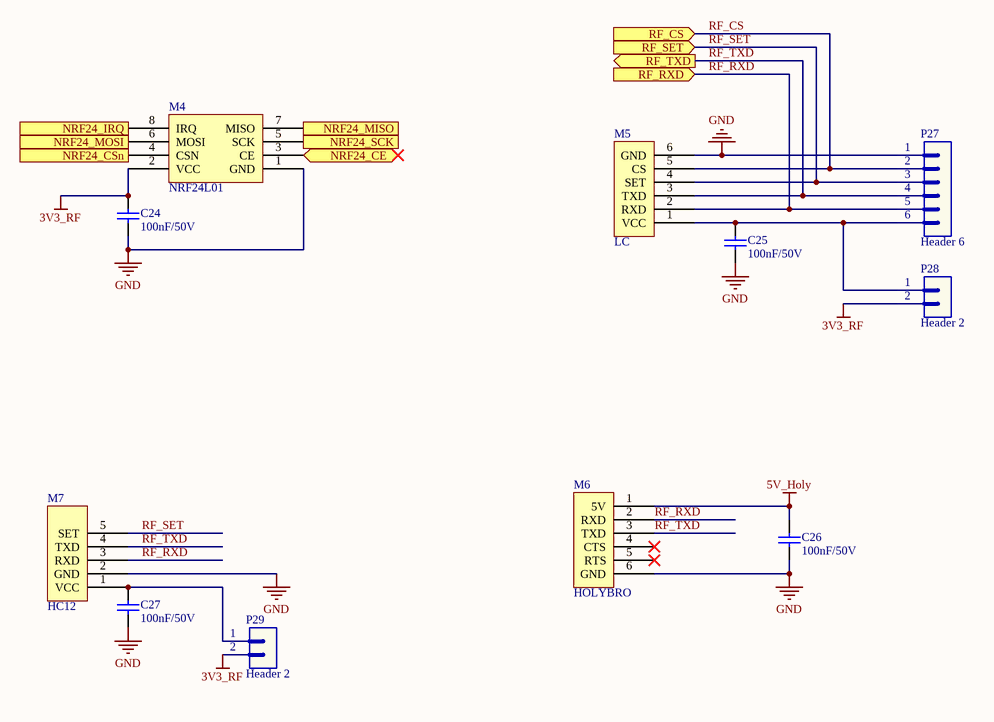
[diagram p6: RF.SchDoc]

### Parts
C24  value 100nF/50V  [CAP-SM-0805]  (hidden comment: Cap-100nF-50V-0805)
C25  value 100nF/50V  [CAP-SM-0805]  (hidden comment: Cap-100nF-50V-0805)
C26  value 100nF/50V  [CAP-SM-0805]  (hidden comment: Cap-100nF-50V-0805)
C27  value 100nF/50V  [CAP-SM-0805]  (hidden comment: Cap-100nF-50V-0805)
M4  NRF24L01  [NRF24L01]
M5  LC  [LC12S]
M6  HOLYBRO  [HOLYBRO]
M7  HC12  [HC12]
P27  Header 6  [JP6]
P28  Header 2  [JP2]
P29  Header 2  [JP2]

### Ports
NRF24_CE (bidir), NRF24_CSn (in), NRF24_IRQ (out), NRF24_MISO (out), NRF24_MOSI (in), NRF24_SCK (in), RF_CS (in), RF_RXD (in), RF_SET (in), RF_TXD (out)

### Nets
3V3_RF: C24.2 M4.2(VCC) P28.2 P29.2
5V_Holy: C26.2 M6.1(5V)  [project net 5V]
GND: C24.1 C25.1 C26.1 C27.1 M4.1(GND) M5.6(GND) M6.6(GND) M7.2(GND) P27.1  [project net VSS]
RF_CS: M5.5(CS) P27.2 ; port RF_CS
RF_RXD: M5.2(RXD) M6.2(RXD) M7.3(RXD) P27.5 ; port RF_RXD
RF_SET: M5.4(SET) M7.5(SET) P27.3 ; port RF_SET
RF_TXD: M5.3(TXD) M6.3(TXD) M7.4(TXD) P27.4 ; port RF_TXD
NetC25_2: C25.2 M5.1(VCC) P27.6 P28.1
NetC27_2: C27.2 M7.1(VCC) P29.1
NetCR1_33: M4.8(IRQ) ; port NRF24_IRQ
NetCR1_38: M4.4(CSN) ; port NRF24_CSn
NetCR1_39: M4.5(SCK) ; port NRF24_SCK
NetCR1_40: M4.7(MISO) ; port NRF24_MISO
NetCR1_41: M4.6(MOSI) ; port NRF24_MOSI
NetM4_3: M4.3(CE) ; port NRF24_CE

Not connected (* = marked no-connect by the designer): M6 4(CTS)* 5(RTS)*

### Library data of the parts
C24-C27 = Cap-100nF-50V-0805: as C21 on sheet Power_Supply; Local Supplier: thegioiic; Local Supplier Link: https://thegioiic.com/products/tu-100nf-0-1uf-50v-0805; Supplier 1: Digikey; Supplier 1 Part Number: 1276-1007-1-ND; Supplier 1 Link: https://www.digikey.com/product-detail/en/samsung-electro-mechanics/CL21F104ZBCNNNC/1276-1007-1-ND/3889093
M5 = LC12S
P27 = Header 6: Header, 6-Pin; LatestRevisionDate: 17-Jul-2002; LatestRevisionNote: Re-released for DXP Platform.; Publisher: Altium Limited
P28 P29 = Header 2: Header, 2-Pin; LatestRevisionDate: 17-Jul-2002; LatestRevisionNote: Re-released for DXP Platform.; Publisher: Altium Limited

## Sheet Decawave.SchDoc
size A
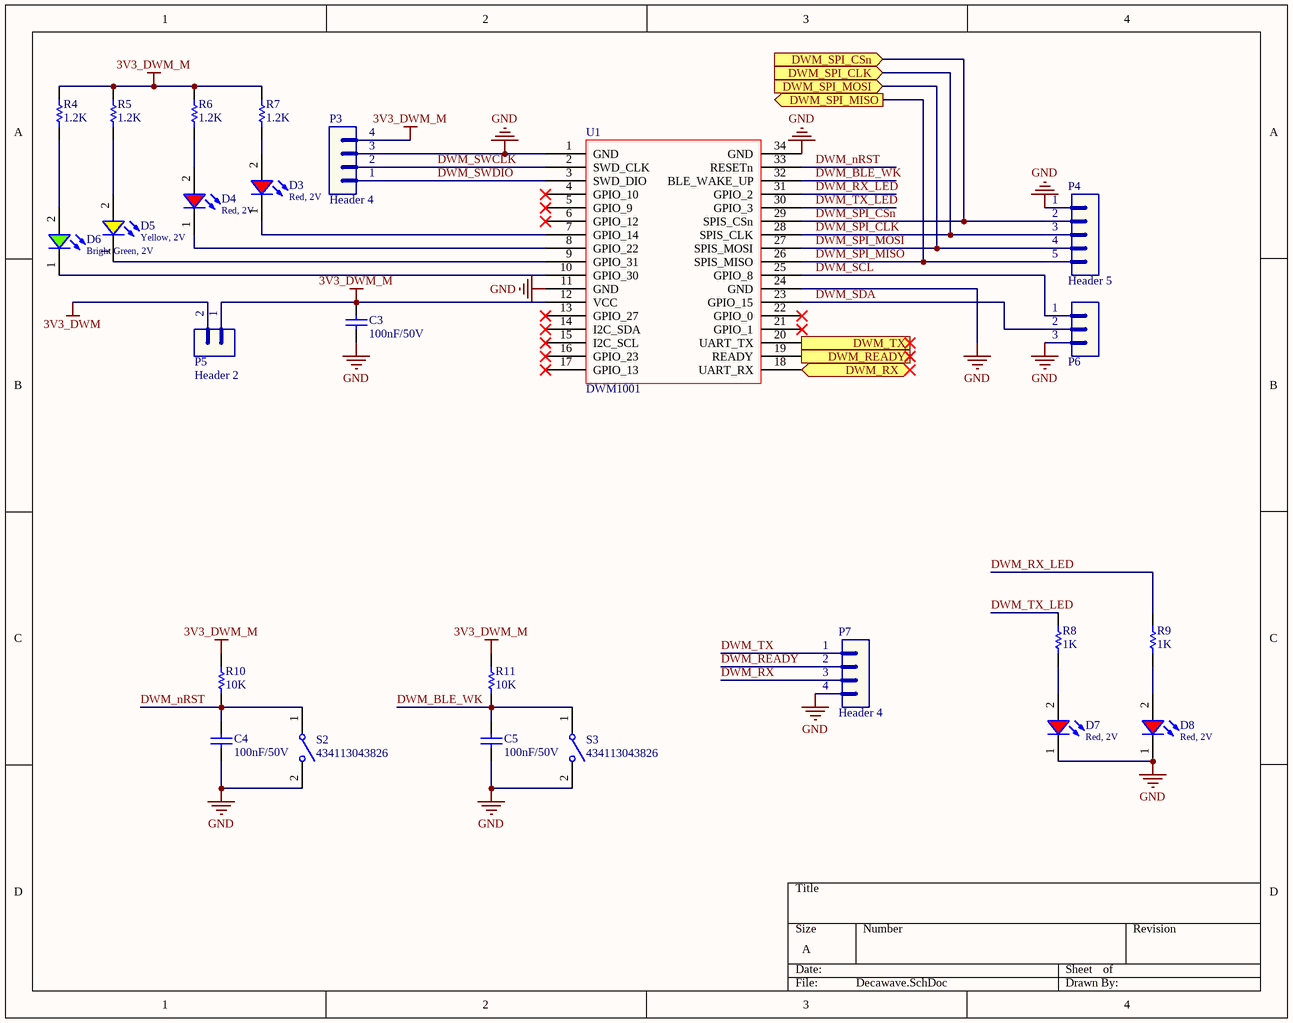
[diagram p7: Decawave.SchDoc]

### Parts
C3  value 100nF/50V  [CAP-SM-0805]  (hidden comment: Cap-100nF-50V-0805)
C4  value 100nF/50V  [CAP-SM-0805]  (hidden comment: Cap-100nF-50V-0805)
C5  value 100nF/50V  [CAP-SM-0805]  (hidden comment: Cap-100nF-50V-0805)
D3  Red, 2V  [WL-SMCW_0805]
D4  Red, 2V  [WL-SMCW_0805]
D5  Yellow, 2V  [WL-SMCW_0805]
D6  Bright Green, 2V  [WL-SMCW_0805]
D7  Red, 2V  [WL-SMCW_0805]
D8  Red, 2V  [WL-SMCW_0805]
P3  Header 4  [JP4]
P4  Header 5  [JP5]
P5  Header 2  [JP2]
P6  Header 3  [JP3]  (value not drawn)
P7  Header 4  [JP4]
R4  value 1.2K  [RES-SM-0805]  (hidden comment: Res-1.2K-0805)
R5  value 1.2K  [RES-SM-0805]  (hidden comment: Res-1.2K-0805)
R6  value 1.2K  [RES-SM-0805]  (hidden comment: Res-1.2K-0805)
R7  value 1.2K  [RES-SM-0805]  (hidden comment: Res-1.2K-0805)
R8  value 1K  [RES-SM-0805]  (hidden comment: Res-1K-0805)
R9  value 1K  [RES-SM-0805]  (hidden comment: Res-1K-0805)
R10  value 10K  [RES-SM-0805]  (hidden comment: Res-10k-0805)
R11  value 10K  [RES-SM-0805]  (hidden comment: Res-10k-0805)
S2  434113043826  [434113043826]
S3  434113043826  [434113043826]
U1  DWM1001  [DWM1001]

### Ports
DWM_READY, DWM_RX (bidir), DWM_SPI_CLK (in), DWM_SPI_CSn (in), DWM_SPI_MISO (out), DWM_SPI_MOSI (in), DWM_TX

### Nets
3V3_DWM: P5.2
3V3_DWM_M: C3.2 P3.4 P5.1 R4.2 R5.2 R6.2 R7.2 R10.1 R11.1 U1.12(VCC)
GND: C3.1 C4.1 C5.1 D7.1(K) D8.1(K) P3.3 P4.1 P6.3 P7.4 S2.2 S3.2 U1.1(GND) U1.11(GND) U1.24(GND) U1.34(GND)  [project net VSS]
DWM_BLE_WK: C5.2 R11.2 S3.1 U1.32(BLE_WAKE_UP)
DWM_nRST: C4.2 R10.2 S2.1 U1.33(RESETn)
DWM_READY: P7.2
DWM_RX: P7.3
DWM_RX_LED: R9.2 U1.31(GPIO_2)
DWM_SCL: P6.1 U1.25(GPIO_8)
DWM_SDA: P6.2 U1.23(GPIO_15)
DWM_SPI_CLK: P4.3 U1.28(SPIS_CLK) ; port DWM_SPI_CLK
DWM_SPI_CSn: P4.2 U1.29(SPIS_CSn) ; port DWM_SPI_CSn
DWM_SPI_MISO: P4.5 U1.26(SPIS_MISO) ; port DWM_SPI_MISO
DWM_SPI_MOSI: P4.4 U1.27(SPIS_MOSI) ; port DWM_SPI_MOSI
DWM_SWCLK: P3.2 U1.2(SWD_CLK)
DWM_SWDIO: P3.1 U1.3(SWD_DIO)
DWM_TX: P7.1
DWM_TX_LED: R8.2 U1.30(GPIO_3)
NetD3_1: D3.1(K) U1.7(GPIO_14)
NetD3_2: D3.2(A) R7.1
NetD4_1: D4.1(K) U1.8(GPIO_22)
NetD4_2: D4.2(A) R6.1
NetD5_1: D5.1(K) U1.9(GPIO_31)
NetD5_2: D5.2(A) R5.1
NetD6_1: D6.1(K) U1.10(GPIO_30)
NetD6_2: D6.2(A) R4.1
NetD7_2: D7.2(A) R8.1
NetD8_2: D8.2(A) R9.1
NetU1_18: U1.18(UART_RX) ; port DWM_RX
NetU1_19: U1.19(READY) ; port DWM_READY
NetU1_20: U1.20(UART_TX) ; port DWM_TX

Not connected (* = marked no-connect by the designer): U1 4(GPIO_10)* 5(GPIO_9)* 6(GPIO_12)* 13(GPIO_27)* 14(I2C_SDA)* 15(I2C_SCL)* 16(GPIO_23)* 17(GPIO_13)* 21(GPIO_1)* 22(GPIO_0)*

### Library data of the parts
C3-C5 = Cap-100nF-50V-0805: as C21 on sheet Power_Supply; Local Supplier: thegioiic; Local Supplier Link: https://thegioiic.com/products/tu-100nf-0-1uf-50v-0805; Supplier 1: Digikey; Supplier 1 Part Number: 1276-1007-1-ND; Supplier 1 Link: https://www.digikey.com/product-detail/en/samsung-electro-mechanics/CL21F104ZBCNNNC/1276-1007-1-ND/3889093
D3 D4 D7 D8 = 150080RS75000: as D9 on sheet MCU; Viewing Angle: 140deg; ComponentLink1Description: Manufacturer; ComponentLink1URL: http://www.we-online.de; ComponentLink2URL: https://www.we-online.com/catalog/datasheet/150080RS75000.pdf; ComponentLink2Description: Datasheet; Forward Voltage typ.: 2V; Emitting Color: Red; Mounting Technology: SMT; Operating Temperature: -40 to +85degC; Published Date: December 2019; Part Number: 150080RS75000; Packaging: Tape and Reel; Size: 0805; Publisher: Wurth Elektronik
D5 = 150080YS75000: as D1 on sheet Blutooth; Viewing Angle: 140deg; ComponentLink1Description: Manufacturer; ComponentLink1URL: http://www.we-online.de; ComponentLink2URL: https://www.we-online.com/catalog/datasheet/150080YS75000.pdf; ComponentLink2Description: Datasheet; Forward Voltage typ.: 2V; Emitting Color: Yellow; Mounting Technology: SMT; Operating Temperature: -40 to +85degC; Published Date: December 2019; Part Number: 150080YS75000; Packaging: Tape and Reel; Size: 0805; Publisher: Wurth Elektronik
D6 = 150080VS75000: WL-SMCW SMT Mono-color Chip LED Waterclear, size 0805, Bright Green, 2V, 140deg; Chip Technology: AlInGaP; Dominant Wavelength typ.: 570nm; Luminous Intensity typ.: 40mcd; Peak Wavelength typ.: 572nm; Viewing Angle: 140deg; ComponentLink1Description: Manufacturer; ComponentLink1URL: http://www.we-online.de; ComponentLink2URL: https://www.we-online.com/catalog/datasheet/150080VS75000.pdf; ComponentLink2Description: Datasheet; Forward Voltage typ.: 2V; Emitting Color: Bright Green; Mounting Technology: SMT; Operating Temperature: -40 to +85degC; Published Date: December 2019; Part Number: 150080VS75000; Packaging: Tape and Reel; Size: 0805; Publisher: Wurth Elektronik
P3 P7 = Header 4: Header, 4-Pin; LatestRevisionDate: 17-Jul-2002; LatestRevisionNote: Re-released for DXP Platform.; Publisher: Altium Limited
P4 = Header 5: Header, 5-Pin; LatestRevisionDate: 17-Jul-2002; LatestRevisionNote: Re-released for DXP Platform.; Publisher: Altium Limited
P5 = Header 2: Header, 2-Pin; LatestRevisionDate: 17-Jul-2002; LatestRevisionNote: Re-released for DXP Platform.; Publisher: Altium Limited
P6 = Header 3: Header, 3-Pin; LatestRevisionDate: 17-Jul-2002; LatestRevisionNote: Re-released for DXP Platform.; Publisher: Altium Limited
R4-R7 = Res-1.2K-0805: RES SMD 1.2K OHM 1% 1/8W 0805; Manufacturer: TE Connectivity Passive Product; Manufacturer Part Number: CRG0805F1K2; Local Supplier: thegioiic; Local Supplier Link: https://thegioiic.com/products/dien-tro-1-2k-ohm-0805-5; Supplier 1: Digikey; Supplier 1 Link: https://www.digikey.com/product-detail/en/te-connectivity-passive-product/CRG0805F1K2/A126346CT-ND/7603401; Supplier 1 Part Number: A126346CT-ND
R8 R9 = Res-1K-0805: as R17 on sheet MCU; Local Supplier: thegioiic; Local Supplier Link: https://thegioiic.com/products/dien-tro-1k-ohm-0805-5; Supplier 1: Digikey; Supplier 1 Link: https://www.digikey.com/product-detail/en/stackpole-electronics-inc/RNCP0805FTD1K00/RNCP0805FTD1K00CT-ND/2240568; Supplier 1 Part Number: RNCP0805FTD1K00CT-ND
R10 R11 = Res-10k-0805: as R12 on sheet MCU; Local Supplier: thegioiic; Local Supplier Link: https://thegioiic.com/products/dien-tro-10k-ohm-0805-5; Supplier 1: Digikey; Supplier 1 Link: https://www.digikey.com/product-detail/en/stackpole-electronics-inc/RNCP0805FTD10K0/RNCP0805FTD10K0CT-ND/2240601; Supplier 1 Part Number: RNCP0805FTD10K0CT-ND
S2 S3 = 434113043826: as S4 on sheet MCU; ComponentLink1Description: Manufacturer; ComponentLink1URL: http://www.we-online.de; ComponentLink2Description: Datasheet; ComponentLink2URL: https://katalog.we-online.com/em/datasheet/434113043826.pdf; Operating Temperature: -40 to +85degC; Part Number: 434113043826; Published Date: September 2019; Contact Material: Stainless Steel; Height: 4.3mm; Mounting Technology: SMT; Contact Plating: Silver; Operation Force: 260gf; Packaging: Tape and Reel; Terminal Material: Copper Alloy; Publisher: Wurth Elektronik; Terminal Plating: Silver

## Nets that join several sheets
3V3_BLU: Power_Supply (C23.2 IC4.2 IC4.4), Blutooth (*1.12 S1.1)
3V3_DWM: Power_Supply (C20.2 IC3.2 IC3.4), Decawave (P5.2)
3V3_RF: Power_Supply (C22.2 U3.5), RF (C24.2 M4.2 P28.2 P29.2)
3V3_WIFI: Power_Supply (C17.2 IC1.2 IC1.4), Wifi (11 pins)
5V: Power_Supply (10 pins), MCU (B*1.1 J1.1), Blutooth (C1.2 M1.5), Motor Control (P13.3), RF (C26.2 M6.1)
5V_WIFI: Power_Supply (IC1.3 P26.2), Wifi (C32.2 C33.2 D11.1 U5.8)
12V: Power_Supply (C14.1 C15.2 P25.1 PI1.1), Motor Control (P11.1 P12.1)
VDD: Power_Supply (C18.2 C19.2 IC2.2 IC2.4), MCU (12 pins), Sensor (6 pins), Motor Control (5 pins)
VSS: Power_Supply (19 pins), MCU (16 pins), Sensor (6 pins), Blutooth (10 pins), Wifi (14 pins), Motor Control (19 pins), RF (9 pins), Decawave (15 pins)
BLU_KEY: MCU (CR1.32), Blutooth (C2.2 P1.2 R3.1 S1.2)
BLUE_RX: MCU (CR1.30), Blutooth (*1.2 M1.2 P2.2)
BLUE_TX: MCU (CR1.31), Blutooth (*1.1 M1.3 P2.1)
DWM_SPI_CLK: MCU (CR1.26), Decawave (P4.3 U1.28)
DWM_SPI_CSn: MCU (CR1.25), Decawave (P4.2 U1.29)
DWM_SPI_MISO: MCU (CR1.27), Decawave (P4.5 U1.26)
DWM_SPI_MOSI: MCU (CR1.28), Decawave (P4.4 U1.27)
ESP_TX: MCU (CR1.13), Wifi (M9.22 U5.25)
Net*1_11: MCU (CR1.14), Blutooth (*1.11)
NetCR1_3: MCU (CR1.3), Motor Control (U2.3)
NetCR1_4: MCU (CR1.4), Motor Control (U2.6)
NetCR1_5: MCU (CR1.5), Motor Control (U2.5)
NetCR1_6: MCU (CR1.6), Motor Control (U2.7)
NetCR1_10: MCU (CR1.10), Motor Control (U2.2)
NetCR1_11: MCU (CR1.11), Motor Control (U2.4)
NetCR1_12: MCU (CR1.12), Wifi (R26.2)
NetCR1_15: Power_Supply (R25.1), MCU (CR1.15)
NetCR1_16: MCU (CR1.16), Sensor (U4.2)
NetCR1_17: MCU (CR1.17), Sensor (U4.4)
NetCR1_33: MCU (CR1.33), RF (M4.8)
NetCR1_38: MCU (CR1.38), RF (M4.4)
NetCR1_39: MCU (CR1.39), RF (M4.5)
NetCR1_40: MCU (CR1.40), RF (M4.7)
NetCR1_41: MCU (CR1.41), RF (M4.6)
NetCR1_42: MCU (CR1.42), Sensor (U4.8)
NetCR1_43: MCU (CR1.43), Sensor (U4.6)
NetCR1_45: MCU (CR1.45), Sensor (M8.3)
NetCR1_46: MCU (CR1.46), Sensor (M8.4)
RF_RXD: MCU (CR1.21), RF (M5.2 M6.2 M7.3 P27.5)
RF_SET: MCU (CR1.19), RF (M5.4 M7.5 P27.3)
RF_TXD: MCU (CR1.22), RF (M5.3 M6.3 M7.4 P27.4)